# Altium schematic sheet usb.SchDoc
size A3
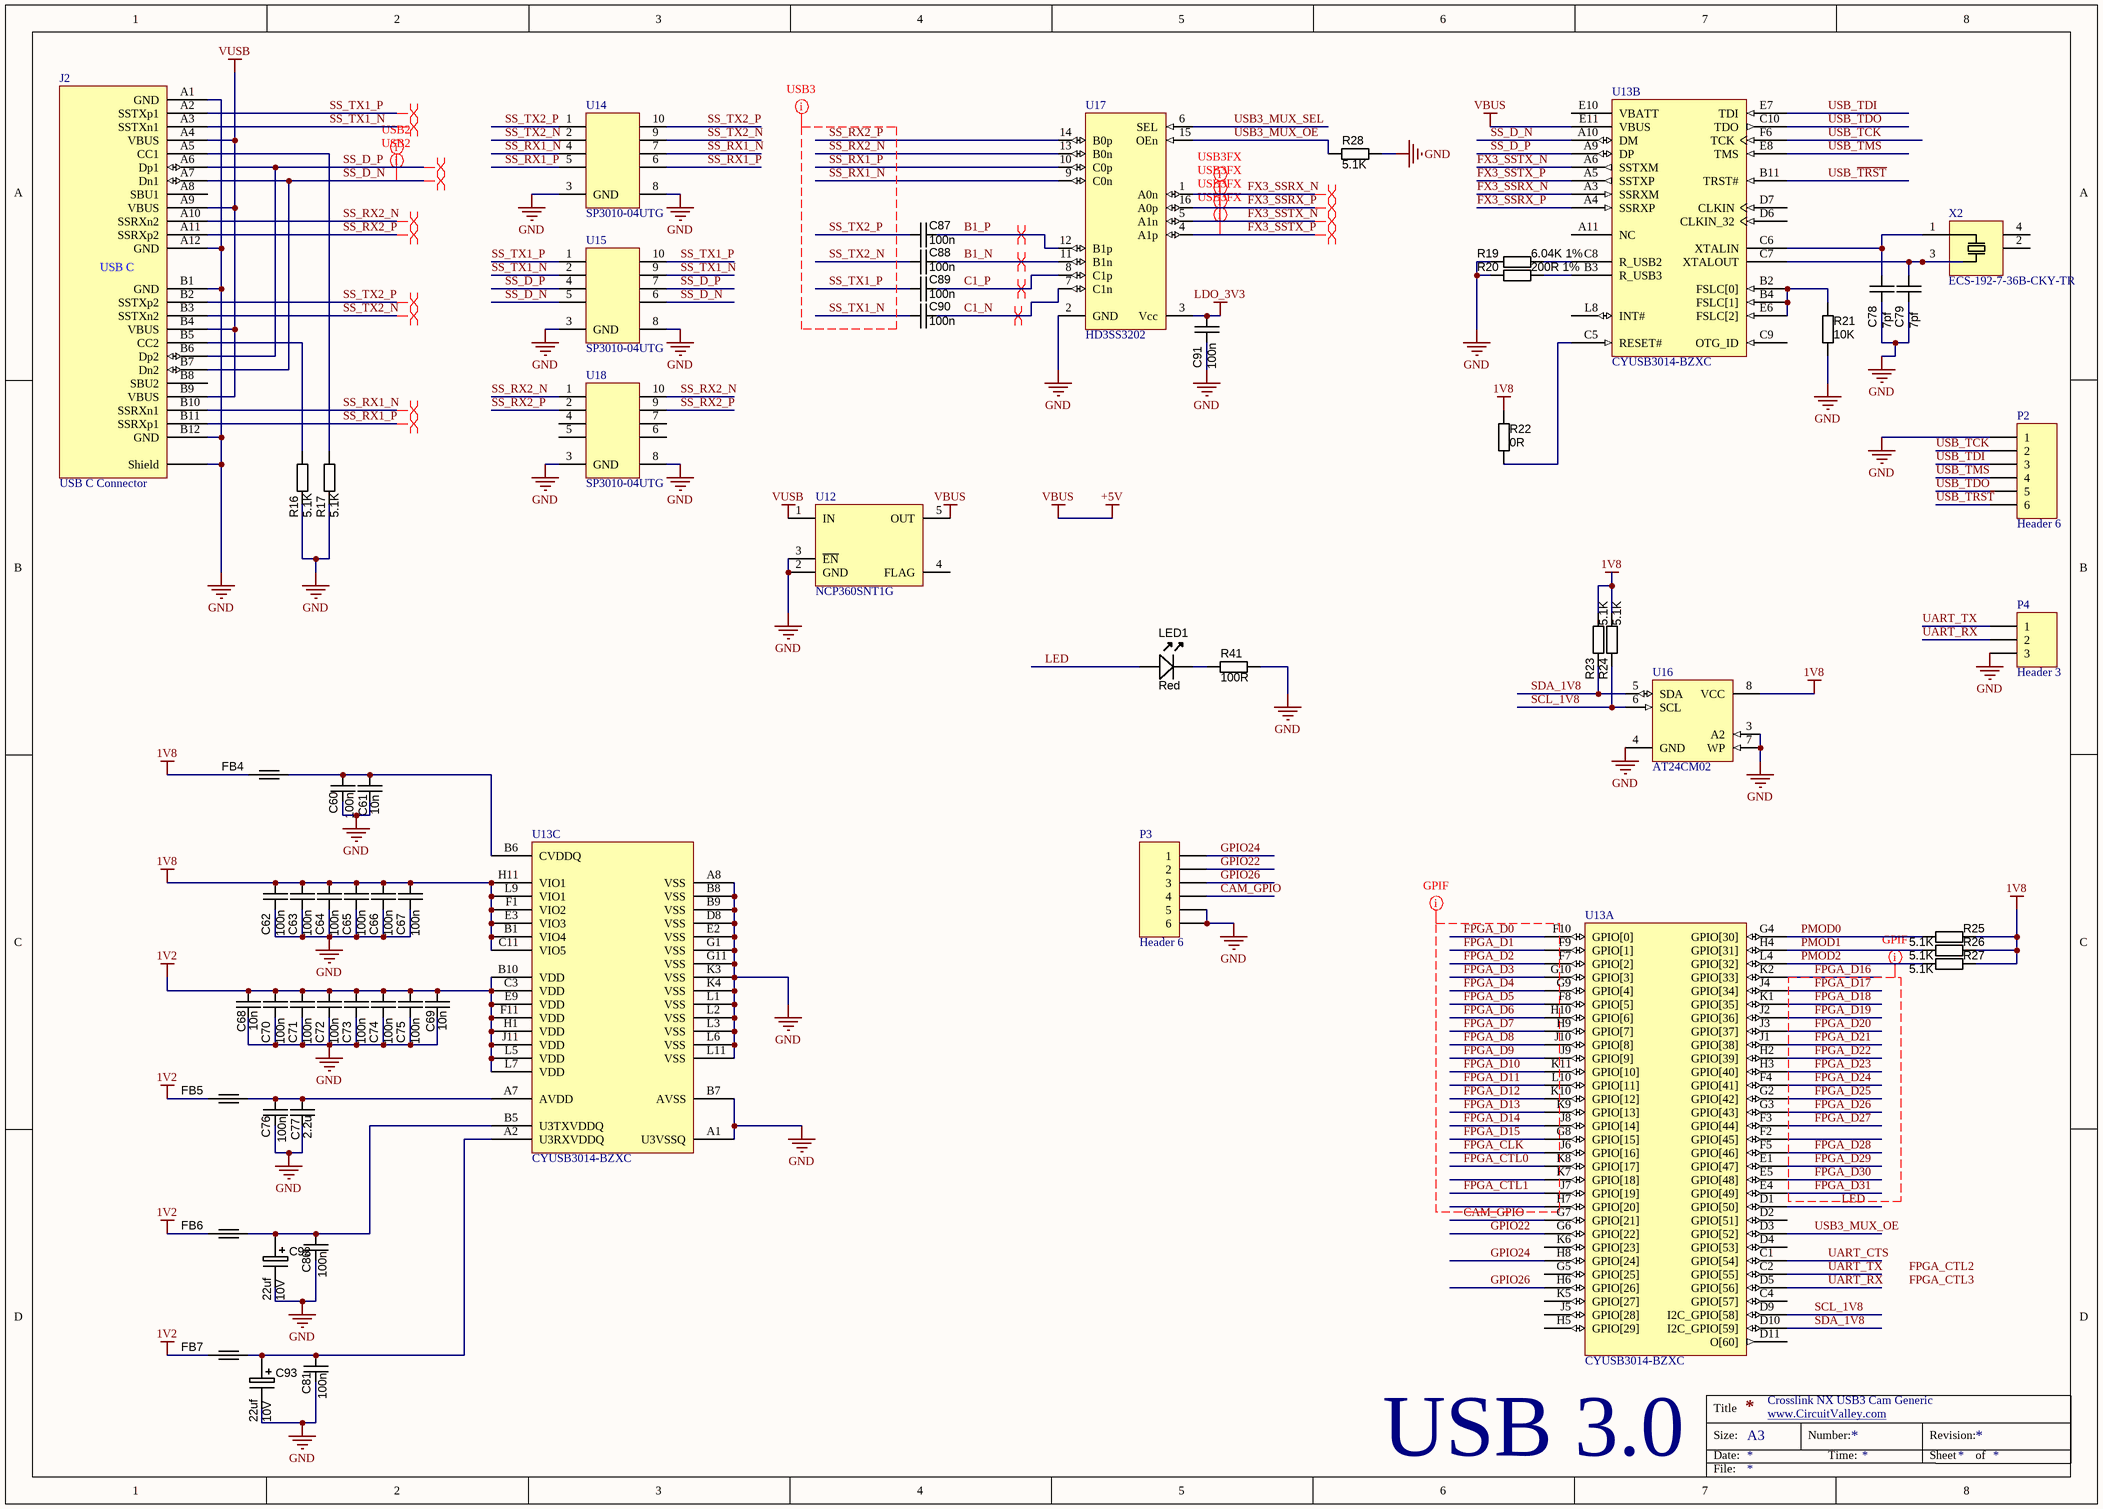
[diagram p0: usb.SchDoc]

## Parts
C60  100n  [CAPC1608N]
C61  10n  [CAPC1608N]
C62  100n  [CAPC1608N]
C63  100n  [CAPC1608N]
C64  100n  [CAPC1608N]
C65  100n  [CAPC1608N]
C66  100n  [CAPC1608N]
C67  100n  [CAPC1608N]
C68  10n  [CAPC1608N]
C69  10n  [CAPC1608N]
C70  100n  [CAPC1608N]
C71  100n  [CAPC1608N]
C72  100n  [CAPC1608N]
C73  100n  [CAPC1608N]
C74  100n  [CAPC1608N]
C75  100n  [CAPC1608N]
C76  100n  [CAPC1608N]
C77  2.2u  [CAPC1608N]
C78  7pf  [CAPC1608N]
C79  7pf  [CAPC1608N]
C80  100n  [CAPC1608N]
C81  100n  [CAPC1608N]
C87  100n  [CAPC1005N]
C88  100n  [CAPC1005N]
C89  100n  [CAPC1005N]
C90  100n  [CAPC1005N]
C91  100n  [CAPC1608N]
C92  Ratings: 10V  [CAPMP3528X210N]  (hidden comment: 22uf)
C93  Ratings: 10V  [CAPMP3528X210N]  (hidden comment: 22uf)
FB4  (no value)  [FBC2012N]
FB5  (no value)  [FBC2012N]
FB6  (no value)  [FBC2012N]
FB7  (no value)  [FBC2012N]
J2  USB C Connector  [10137062-00021LF]
LED1  Red  [LED-0603-RED]
P2  Header 6  [SMD_Solder_points_1.27]
P3  Header 6  [SMD_Solder_points_1.27]
P4  Header 3  [SMD_3Solder_points_1.27]
R16  value 5.1K  [RESC1608N_ZERO]  (hidden comment: Thick Film)
R17  value 5.1K  [RESC1608N_ZERO]  (hidden comment: Thick Film)
R19  value 6.04K 1%  [RESC1608N_ZERO]  (hidden comment: Thick Film)
R20  value 200R 1%  [RESC1608N_ZERO]  (hidden comment: Thick Film)
R21  value 10K  [RESC1608N_ZERO]  (hidden comment: Thick Film)
R22  value 0R  [RESC1608N_ZERO]  (hidden comment: Thick Film)
R23  value 5.1K  [RESC1608N_ZERO]  (hidden comment: Thick Film)
R24  value 5.1K  [RESC1608N_ZERO]  (hidden comment: Thick Film)
R25  value 5.1K  [RESC1608N_ZERO]  (hidden comment: Thick Film)
R26  value 5.1K  [RESC1608N_ZERO]  (hidden comment: Thick Film)
R27  value 5.1K  [RESC1608N_ZERO]  (hidden comment: Thick Film)
R28  value 5.1K  [RESC1608N_ZERO]  (hidden comment: Thick Film)
R41  value 100R  [RESC1608N_ZERO]  (hidden comment: Thick Film)
U12  NCP360SNT1G  [SOT23-5]
U13  CYUSB3014-BZXC  [CYP-BZX121]  (parts A,B,C of 3)
U14  SP3010-04UTG  [uDFN-10]
U15  SP3010-04UTG  [uDFN-10]
U16  AT24CM02  [SOIC8]
U17  HD3SS3202  [UQFN-16]
U18  SP3010-04UTG  [uDFN-10]
X2  ECS-192-7-36B-CKY-TR  [Active Oscillator 2520]

## Nets
1V2: C68.2 C69.2 C70.2 C71.2 C72.2 C73.2 C74.2 C75.2 FB5.1 FB6.1 FB7.1 U13.B10(VDD) U13.C3(VDD) U13.E9(VDD) U13.F11(VDD) U13.H1(VDD) U13.J11(VDD) U13.L5(VDD) U13.L7(VDD)
1V8: C62.2 C63.2 C64.2 C65.2 C66.2 C67.2 FB4.1 R22.2 R23.2 R24.1 R25.2 R26.2 R27.2 U13.B1(VIO4) U13.C11(VIO5) U13.E3(VIO3) U13.F1(VIO2) U13.H11(VIO1) U13.L9(VIO1) U16.8(VCC)
+5V: U12.5(OUT) U13.E11(VBUS)  [also labelled VBUS]
GND: C60.1 C61.1 C62.1 C63.1 C64.1 C65.1 C66.1 C67.1 C68.1 C69.1 C70.1 C71.1 C72.1 C73.1 C74.1 C75.1 C76.1 C77.1 C78.1 C79.1 C80.1 C81.1 C91.1 C92.2 C93.2 J2.0(Shield) J2.A1(GND) J2.A12(GND) J2.B1(GND) J2.B12(GND) P2.1 P3.5 P3.6 P4.3 R16.2 R17.2 R19.2 R20.2 R21.2 R28.2 R41.2 U12.2(GND) U12.3(~{EN}) U13.A1(U3VSSQ) U13.A8(VSS) U13.B7(AVSS) U13.B8(VSS) U13.B9(VSS) U13.D8(VSS) U13.E2(VSS) U13.G1(VSS) U13.G11(VSS) U13.K3(VSS) U13.K4(VSS) U13.L1(VSS) U13.L2(VSS) U13.L3(VSS) U13.L6(VSS) U13.L11(VSS) U14.3(GND) U14.8(GND) U15.3(GND) U15.8(GND) U16.3(A2) U16.4(GND) U16.7(WP) U17.2(GND) U18.3(GND) U18.8(GND)
LDO_3V3: C91.2 U17.3(Vcc)
VUSB: J2.A4(VBUS) J2.A9(VBUS) J2.B4(VBUS) J2.B9(VBUS) U12.1(IN)
B1_N: C88.2 U17.11(B1n)
B1_P: C87.2 U17.12(B1p)
C1_N: C90.2 U17.7(C1n)
C1_P: C89.2 U17.8(C1p)
CAM_GPIO: P3.4 U13.G7(GPIO[21])
FPGA_CLK: U13.J6(GPIO[16])
FPGA_CTL0: U13.K8(GPIO[17])
FPGA_CTL1: U13.J7(GPIO[19])
FPGA_D0: U13.F10(GPIO[0])
FPGA_D1: U13.F9(GPIO[1])
FPGA_D2: U13.F7(GPIO[2])
FPGA_D3: U13.G10(GPIO[3])
FPGA_D4: U13.G9(GPIO[4])
FPGA_D5: U13.F8(GPIO[5])
FPGA_D6: U13.H10(GPIO[6])
FPGA_D7: U13.H9(GPIO[7])
FPGA_D8: U13.J10(GPIO[8])
FPGA_D9: U13.J9(GPIO[9])
FPGA_D10: U13.K11(GPIO[10])
FPGA_D11: U13.L10(GPIO[11])
FPGA_D12: U13.K10(GPIO[12])
FPGA_D13: U13.K9(GPIO[13])
FPGA_D14: U13.J8(GPIO[14])
FPGA_D15: U13.G8(GPIO[15])
FPGA_D16: U13.K2(GPIO[33])
FPGA_D17: U13.J4(GPIO[34])
FPGA_D18: U13.K1(GPIO[35])
FPGA_D19: U13.J2(GPIO[36])
FPGA_D20: U13.J3(GPIO[37])
FPGA_D21: U13.J1(GPIO[38])
FPGA_D22: U13.H2(GPIO[39])
FPGA_D23: U13.H3(GPIO[40])
FPGA_D24: U13.F4(GPIO[41])
FPGA_D25: U13.G2(GPIO[42])
FPGA_D26: U13.G3(GPIO[43])
FPGA_D27: U13.F3(GPIO[44])
FPGA_D28: U13.F5(GPIO[46])
FPGA_D29: U13.E1(GPIO[47])
FPGA_D30: U13.E5(GPIO[48])
FPGA_D31: U13.E4(GPIO[49])
FX3_SSRX_N: U13.A3(SSRXM) U17.1(A0n)
FX3_SSRX_P: U13.A4(SSRXP) U17.16(A0p)
FX3_SSTX_N: U13.A6(SSTXM) U17.5(A1n)
FX3_SSTX_P: U13.A5(SSTXP) U17.4(A1p)
GPIO22: P3.2 U13.G6(GPIO[22])
GPIO24: P3.1 U13.H8(GPIO[24])
GPIO26: P3.3 U13.H6(GPIO[26])
LED: LED1.A U13.D1(GPIO[50])
PMOD0: R25.1 U13.G4(GPIO[30])
PMOD1: R26.1 U13.H4(GPIO[31])
PMOD2: R27.1 U13.L4(GPIO[32])
SCL_1V8: R24.2 U13.D9(I2C_GPIO[58]) U16.6(SCL)
SDA_1V8: R23.1 U13.D10(I2C_GPIO[59]) U16.5(SDA)
SS_D_N: J2.A7(Dn1) J2.B7(Dn2) U13.A10(DM) U15.5 U15.6
SS_D_P: J2.A6(Dp1) J2.B6(Dp2) U13.A9(DP) U15.4 U15.7
SS_RX1_N: J2.B10(SSRXn1) U14.4 U14.7 U17.9(C0n)
SS_RX1_P: J2.B11(SSRXp1) U14.5 U14.6 U17.10(C0p)
SS_RX2_N: J2.A10(SSRXn2) U17.13(B0n) U18.1 U18.10
SS_RX2_P: J2.A11(SSRXp2) U17.14(B0p) U18.2 U18.9
SS_TX1_N: C90.1 J2.A3(SSTXn1) U15.2 U15.9
SS_TX1_P: C89.1 J2.A2(SSTXp1) U15.1 U15.10
SS_TX2_N: C88.1 J2.B3(SSTXn2) U14.2 U14.9
SS_TX2_P: C87.1 J2.B2(SSTXp2) U14.1 U14.10
UART_CTS: U13.C1(GPIO[54])
UART_RX: P4.2 U13.D5(GPIO[56])
UART_TX: P4.1 U13.C2(GPIO[55])
USB3_MUX_OE: R28.1 U13.D3(GPIO[52]) U17.15(OEn)
USB3_MUX_SEL: U17.6(SEL)
USB_~{TRST}: P2.6 U13.B11(TRST#)
USB_TCK: P2.2 U13.F6(TCK)
USB_TDI: P2.3 U13.E7(TDI)
USB_TDO: P2.5 U13.C10(TDO)
USB_TMS: P2.4 U13.E8(TMS)
NetC60_2: C60.2 C61.2 FB4.2 U13.B6(CVDDQ)
NetC76_2: C76.2 C77.2 FB5.2 U13.A7(AVDD)
NetC78_2: C78.2 U13.C6(XTALIN) X2.1(X1)
NetC79_2: C79.2 U13.C7(XTALOUT) X2.3(X2)
NetC80_2: C80.2 C92.1 FB6.2 U13.B5(U3TXVDDQ)
NetC81_2: C81.2 C93.1 FB7.2 U13.A2(U3RXVDDQ)
NetJ2_A5: J2.A5(CC1) R17.1
NetJ2_B5: J2.B5(CC2) R16.1
NetLED1_K: LED1.K R41.1
NetR19_1: R19.1 U13.C8(R_USB2)
NetR20_1: R20.1 U13.B3(R_USB3)
NetR21_1: R21.1 U13.B2(FSLC[0]) U13.B4(FSLC[1]) U13.E6(FSLC[2])
NetR22_1: R22.1 U13.C5(RESET#)

Not connected (* = marked no-connect by the designer): J2 A8(SBU1) B8(SBU2); U12 4(FLAG); U13 A11(NC) C4(GPIO[57]) C9(OTG_ID) D2(GPIO[51]) D4(GPIO[53]) D6(CLKIN_32) D7(CLKIN) D11(O[60]) E10(VBATT) F2(GPIO[45]) G5(GPIO[25]) H5(GPIO[29]) H7(GPIO[20]) J5(GPIO[28]) K5(GPIO[27]) K6(GPIO[23]) K7(GPIO[18]) L8(INT#); U18 4 5 6 7; X2 2(NC) 4(NC)

## Layout directives
differential pair: B1_N, B1_P, C1_N, C1_P, FX3_SSRX_N, FX3_SSRX_P, FX3_SSTX_N, FX3_SSTX_P, SS_D_N, SS_D_P, SS_RX1_N, SS_RX1_P, SS_RX2_N, SS_RX2_P, SS_TX1_N, SS_TX1_P, SS_TX2_N, SS_TX2_P
net class USB2: SS_D_N, SS_D_P
net class GPIF: FPGA_CLK, FPGA_CTL0, FPGA_CTL1, FPGA_D0, FPGA_D1, FPGA_D2, FPGA_D3, FPGA_D4, FPGA_D5, FPGA_D6, FPGA_D7, FPGA_D8, FPGA_D9, FPGA_D10, FPGA_D11, FPGA_D12, FPGA_D13, FPGA_D14, FPGA_D15, FPGA_D16, FPGA_D17, FPGA_D18, FPGA_D19, FPGA_D20, FPGA_D21, FPGA_D22, FPGA_D23, FPGA_D24, FPGA_D25, FPGA_D26, FPGA_D27, FPGA_D28, FPGA_D29, FPGA_D30, FPGA_D31
net class USB3: SS_RX1_N, SS_RX1_P, SS_RX2_N, SS_RX2_P, SS_TX1_N, SS_TX1_P, SS_TX2_N, SS_TX2_P
net class USB3FX: FX3_SSRX_N, FX3_SSRX_P, FX3_SSTX_N, FX3_SSTX_P

## Notes on the sheet
- Crosslink NX USB3 Cam Generic
- www.CircuitValley.com <http://www.CircuitValley.com>
- (near U13) USB 3.0
- Labels drawn without touching a wire or pin: FPGA_CTL2, FPGA_CTL3
- Title
- Size:
- Date:
- A3
- Number:
- Time:
- Revision:
- Sheet
- of
- File:
- (in symbol USB_C) USB C

## Library data of the parts
C60-C81 C91 = CAPC_10p_0603_NP0_1%_50V: Capacitor SMD Cer 10pF 5% 50V NP0 0603; Manufacturer 1: Murata Electronics North America; Manufacturer Part Number 1: GRM1885C1H100FA01J; Part: C0603X104K5RAC; Ratings: 50V; NP0; Tolerance: ±5%; Operating Temperature: -55°C ~ 125°C; Package / Case: 0603 (1608 Metric); Size / Dimension: 0.063" L x 0.032" W (1.60mm x 0.81mm); Thickness (Max): 0.035" (0.90mm); Supplier 1: Digi-Key; Supplier Part Number 1: GRM1885C1H100FA01J-ND
  C60 C62-C67 C70-C76 C80 C81 C91: Value: 100n
  C61 C68 C69: Value: 10n
  C77: Value: 2.2u
  C78 C79: Value: 7pf
C87-C90 = CAPC_10n_0402_16V_10%: Capacitor SMD Cer 10nF 10% 16V X7R 0402; Manufacturer 1: AVX Corporation; Manufacturer Part Number 1: 0402YC103KAT2A; Ratings: 16V; X7R; Tolerance: ±10%; Operating Temperature: -55°C ~ 125°C; Package / Case: 0402 (1005 Metric); Size / Dimension: 0.039" L x 0.020" W (1.00mm x 0.50mm); Manufacturer 2: Yageo; Manufacturer Part Number 2: CC0402KRX7R7BB103; Supplier 1: Digi-Key; Supplier Part Number 1: 478-1114-1-ND; ComponentLink1URL: http://www.avx.com/docs/Catalogs/cx7r.pdf; ComponentLink1Description: http://www.avx.com/docs/Catalogs/cx7r.pdf; Supplier 2: Digi-Key; Supplier Part Number 2: 311-1042-1-ND; ComponentLink2URL: http://www.yageo.com/documents/recent/UPY-GPHC_X7R_6.3V-to-50V_8.pdf; ComponentLink2Description: http://www.yageo.com/documents/recent/UPY-GPHC_X7R_6.3V-to-50V_8.pdf; Value: 100n
C92 C93 = CAPT_47u_1210_6V3: Capacitor SMD Tantalum 47uF 20% 6.3V 1210; Manufacturer 1: AVX Corporation; Manufacturer Part Number 1: TCJB476M006R0070; Manufacturer Size Code: B; Voltage - Rated: 6V3; ESR (Equivalent Series Resistance): 70.0 mOhm; Type: Molded; Package / Case: 1210 (3528 Metric); Tolerance: ±20%; Material: Tantalum; Supplier 1: Digi-Key; Supplier Part Number 1: 478-3139-1-ND; Operating Temperature: -55°C ~ 125°C; Size / Dimension: 0.138" L x 0.110" W (3.50mm x 2.80mm); Height - Seated (Max): 0.083" (2.10mm); ComponentLink1URL: http://www.avx.com/docs/Catalogs/tcj.pdf; ComponentLink1Description: http://www.avx.com/docs/Catalogs/tcj.pdf; Value: 22uf
FB4-FB7 = FERRITE_0805: Ferrite bead 2.2K Ohm at 100 MHz 200mA 0805 SMD; Manufacturer 1: Laird-Signal Integrity Products; Manufacturer Part Number 1: HZ0805B222R-10; Ratings: 200 mA; 800 mOhm DC; Impedance @ Frequency: 600 Ohm @ 100MHz; DC Resistance (DCR): 800 mOhm Max; Filter Type: Differential Mode - Single; Size / Dimension: 0.063" L x 0.031" W (1.60mm x 0.80mm); Current Rating: 200mA; Package / Case: 0805 (2012 Metric); Height (Max): 0.043" (1.09mm); ComponentLink1URL: http://www.lairdtech.com/WorkArea/linkit.aspx?LinkIdentifier=id&ItemID=4879; ComponentLink1Description: http://www.lairdtech.com/WorkArea/linkit.aspx?LinkIdentifier=id&ItemID=4879; Supplier 1: Digi-Key; Supplier Part Number 1: 240-2562-1-ND; Mounting Type: Surface Mount
J2 = USB_C
LED1 = LED_SMD_Red_0603_220mcd: LED 0603 SMD Hyper Red 630nm 220mcd 20mA; Manufacturer 1: Kingbright Corp; Manufacturer Part Number 1: APT1608SURCK; Material: AlGaInP on GaAs; Ratings: 220 mcd; 630 nm; Voltage - Forward (Vf) Typ: 1.95V; Voltage - Forward (Vf) @ 10mA: 1.9V; Package / Case: 0603 (1608 metric); Supplier 1: Digi-Key; Supplier Part Number 1: 754-1123-1-ND
P2 P3 = Header 6: Header, 6-Pin; LatestRevisionDate: 17-Jul-2002; LatestRevisionNote: Re-released for DXP Platform.; Publisher: Altium Limited
P4 = Header 3: Header, 3-Pin; LatestRevisionDate: 17-Jul-2002; LatestRevisionNote: Re-released for DXP Platform.; Publisher: Altium Limited
R16 R17 R19-R28 R41 = RES_0R_0603: Resistor SMD chip 0.0 Ohm 0.1W 0603; Manufacturer 1: Vishay/Dale; Manufacturer Part Number 1: CRCW06030000Z0EA; Tolerance: ±5%; Ratings: 1/10W; Package / Case: 0603 (1608metric); Supplier 1: Digi-Key; Supplier Part Number 1: 541-0.0GCT-ND
U12 = NCP360SNT1G: USB Overvoltage Protection
U13 = CYUSB3014-BZXC: EZ-USB(R) FX3: SuperSpeed USB Controller, 512 KB, 60 I/Os, 0 to 70 degC, 121-Pin FBGA (BZX121); Manufacturer: Cypress; CPU Core: ARM926 EJ-S; Max. Operating Voltage (V): 1.25; Memory Architecture: SRAM; Memory Size (KB): 512; Min. Operating Voltage (V): 1.15; No. of I/Os: 60; DatasheetVersion: Rev. *O; PackageVersion: Rev. *D; PackageReference: BZX121; PackageDescription: 121-Ball FBGA, Body 10 x 10 mm, Pitch 0.8 mm; Supplier 1: Digi-Key; Supplier Part Number 1: 428-3182-ND; Supplier 2: Farnell; Supplier Part Number 2: 2355789; Supplier 3: Newark; Supplier Part Number 3: 54W7901; Supplier 4: Mouser; Supplier Part Number 4: 727-CYUSB3014-BZXC; Max. Operating Temp. (degreesC): 70; Min. Operating Temp. (degreesC): 0; RoHS: Pb-Free; Mounting Technology: Surface Mount; Code_JEDEC: PUB 95; PartNumber: CYUSB3014-BZXC; ComponentLink1Description: Manufacturer URL; ComponentLink1URL: http://www.cypress.com/; ComponentLink2Description: Datasheet; ComponentLink2URL: http://www.cypress.com/?docID=49087; ComponentLink3Description: Package Specification; ComponentLink3URL: http://www.cypress.com/?docID=45795
U14 U15 U18 = SP3010-04UTG: ESD Protection
U16 = AT24CM02: 2Mbit I2C EEPROM
U17 = HD3SS3202: USB 3.0 Mux
X2 = Crystal: Crystal Oscillator